# EAGLE design matchbox_bob_v10 (EAGLE 7.4.0)
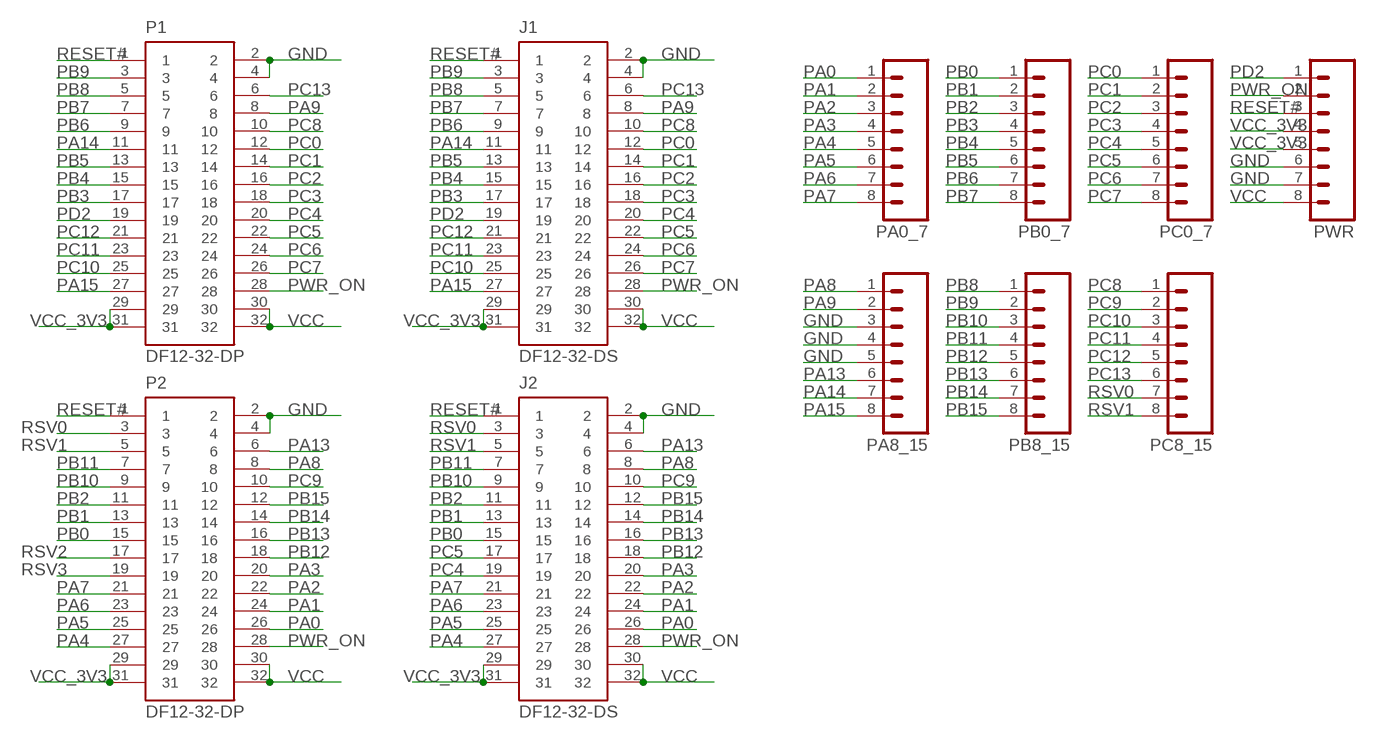
[diagram p0: schematic, sheet 1]

## Parts
J1  DF12-32-DS  AS-ITM-00012  [DF12-32-DS]
J2  DF12-32-DS  AS-ITM-00012  [DF12-32-DS]
P1  DF12-32-DP  AS-ITM-00015  [DF12-32-DP]
P2  DF12-32-DP  AS-ITM-00015  [DF12-32-DP]
PA0_7  M08FEMALE_LOCK  [1X08_FEMALE_LOCK]
PA8_15  M08FEMALE_LOCK  [1X08_FEMALE_LOCK]
PB0_7  M08FEMALE_LOCK  [1X08_FEMALE_LOCK]
PB8_15  M08FEMALE_LOCK  [1X08_FEMALE_LOCK]
PC0_7  M08FEMALE_LOCK  [1X08_FEMALE_LOCK]
PC8_15  M08FEMALE_LOCK  [1X08_FEMALE_LOCK]
PWR  M08FEMALE_LOCK  [1X08_FEMALE_LOCK]

## Nets
GND: J1.2 J1.4 J2.2 J2.4 P1.2 P1.4 P2.2 P2.4 PA8_15.3 PA8_15.4 PA8_15.5 PWR.6 PWR.7
PA0: J2.26 P2.26 PA0_7.1
PA1: J2.24 P2.24 PA0_7.2
PA2: J2.22 P2.22 PA0_7.3
PA3: J2.20 P2.20 PA0_7.4
PA4: J2.27 P2.27 PA0_7.5
PA5: J2.25 P2.25 PA0_7.6
PA6: J2.23 P2.23 PA0_7.7
PA7: J2.21 P2.21 PA0_7.8
PA8: J2.8 P2.8 PA8_15.1
PA9: J1.8 P1.8 PA8_15.2
PA13: J2.6 P2.6 PA8_15.6
PA14: J1.11 P1.11 PA8_15.7
PA15: J1.27 P1.27 PA8_15.8
PB0: J2.15 P2.15 PB0_7.1
PB1: J2.13 P2.13 PB0_7.2
PB2: J2.11 P2.11 PB0_7.3
PB3: J1.17 P1.17 PB0_7.4
PB4: J1.15 P1.15 PB0_7.5
PB5: J1.13 P1.13 PB0_7.6
PB6: J1.9 P1.9 PB0_7.7
PB7: J1.7 P1.7 PB0_7.8
PB8: J1.5 P1.5 PB8_15.1
PB9: J1.3 P1.3 PB8_15.2
PB10: J2.9 P2.9 PB8_15.3
PB11: J2.7 P2.7 PB8_15.4
PB12: J2.18 P2.18 PB8_15.5
PB13: J2.16 P2.16 PB8_15.6
PB14: J2.14 P2.14 PB8_15.7
PB15: J2.12 P2.12 PB8_15.8
PC0: J1.12 P1.12 PC0_7.1
PC1: J1.14 P1.14 PC0_7.2
PC2: J1.16 P1.16 PC0_7.3
PC3: J1.18 P1.18 PC0_7.4
PC4: J1.20 J2.19 P1.20 PC0_7.5
PC5: J1.22 J2.17 P1.22 PC0_7.6
PC6: J1.24 P1.24 PC0_7.7
PC7: J1.26 P1.26 PC0_7.8
PC8: J1.10 P1.10 PC8_15.1
PC9: J2.10 P2.10 PC8_15.2
PC10: J1.25 P1.25 PC8_15.3
PC11: J1.23 P1.23 PC8_15.4
PC12: J1.21 P1.21 PC8_15.5
PC13: J1.6 P1.6 PC8_15.6
PD2: J1.19 P1.19 PWR.1
PWR_ON: J1.28 J2.28 P1.28 P2.28 PWR.2
RESET#: J1.1 J2.1 P1.1 P2.1 PWR.3
RSV0: J2.3 P2.3 PC8_15.7
RSV1: J2.5 P2.5 PC8_15.8
RSV2: P2.17
RSV3: P2.19
VCC: J1.30 J1.32 J2.30 J2.32 P1.30 P1.32 P2.30 P2.32 PWR.8
VCC_3V3: J1.29 J1.31 J2.29 J2.31 P1.29 P1.31 P2.29 P2.31 PWR.4 PWR.5

## Library data of the parts
J1 J2 = micro1292:AS-ITM-00012: CONN RECEPT 32POS 3MM SMD 0.5MM; PARTNO: AS-ITM-00012
P1 P2 = micro1292:AS-ITM-00015: CONN HEADER 32POS 3MM SMD 0.5MM; PARTNO: AS-ITM-00015
PA0_7 PA8_15 PB0_7 PB8_15 PC0_7 PC8_15 PWR = SparkFun-Connectors:M08: Header 8 Standard 8-pin 0.1" header. Use with straight break away headers (SKU : PRT-00116), right angle break away headers (PRT-00553), swiss pins (PRT-00743), machine pins (PRT-00117), and female headers (PRT-00115).

## Board
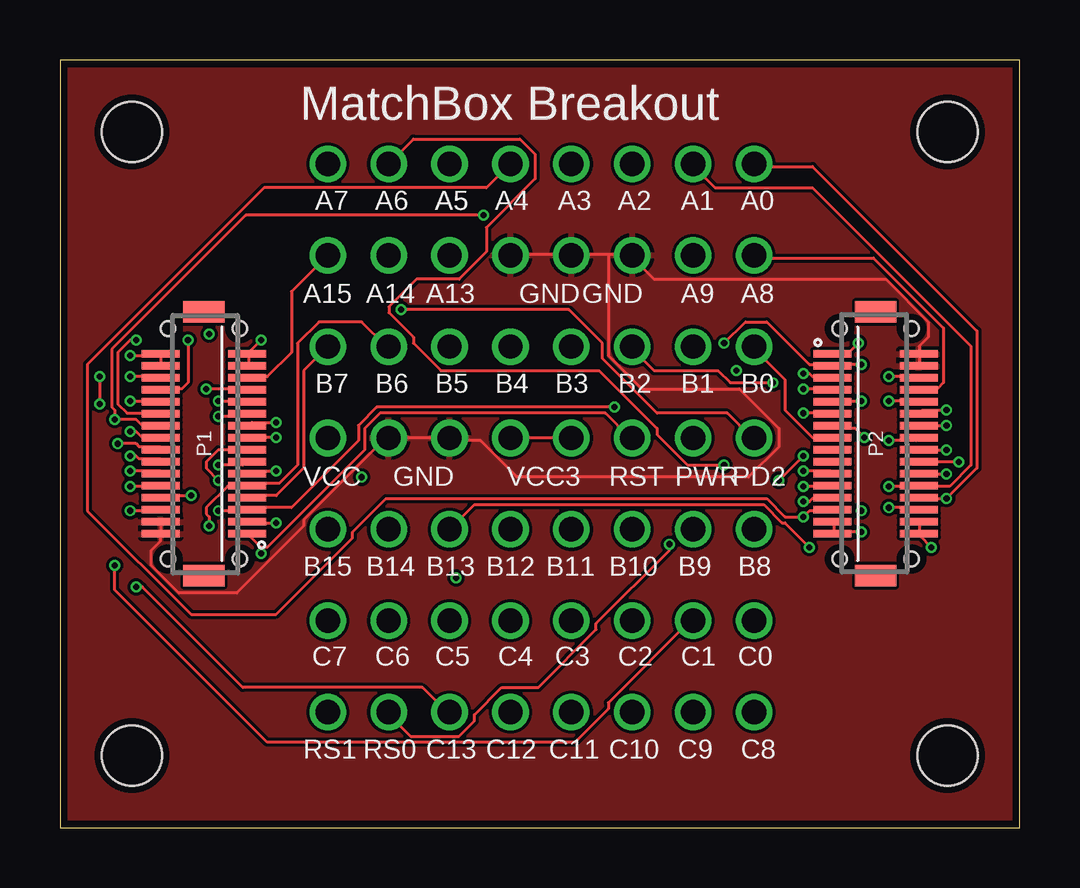
[diagram p1: board, top side]
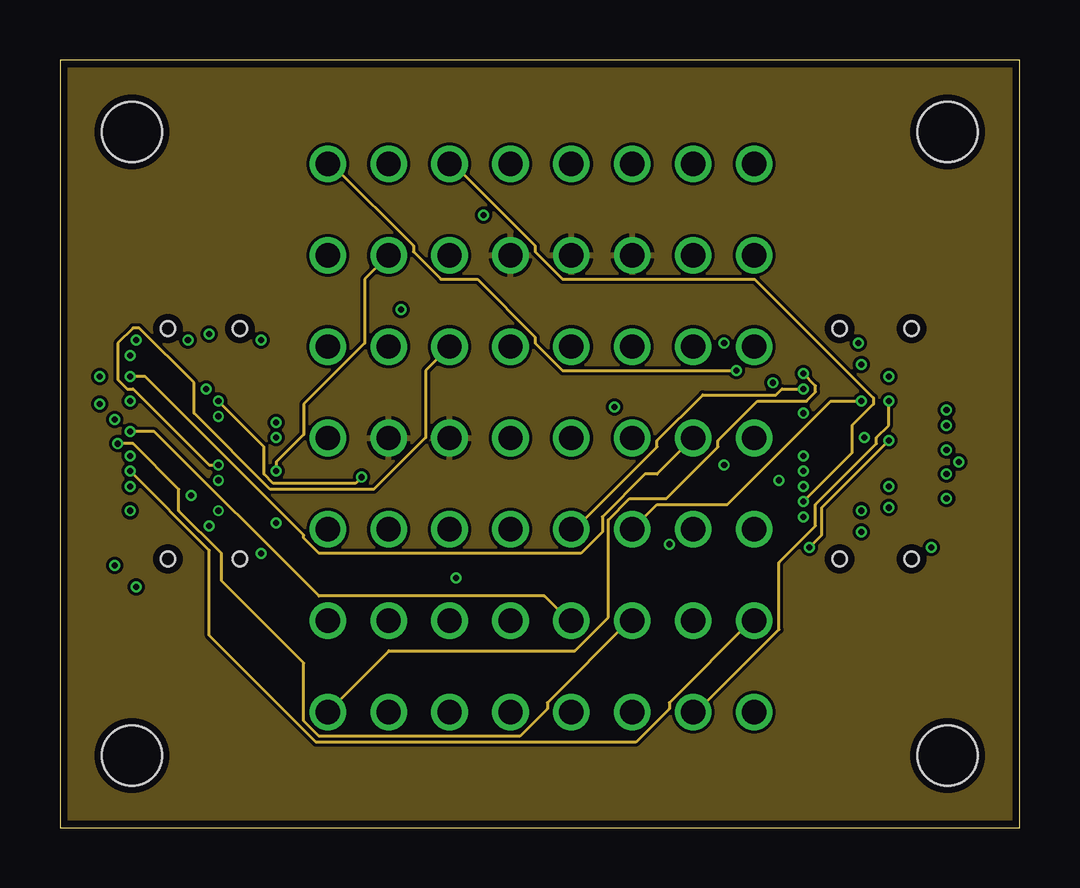
[diagram p2: board, inner layer Route2]
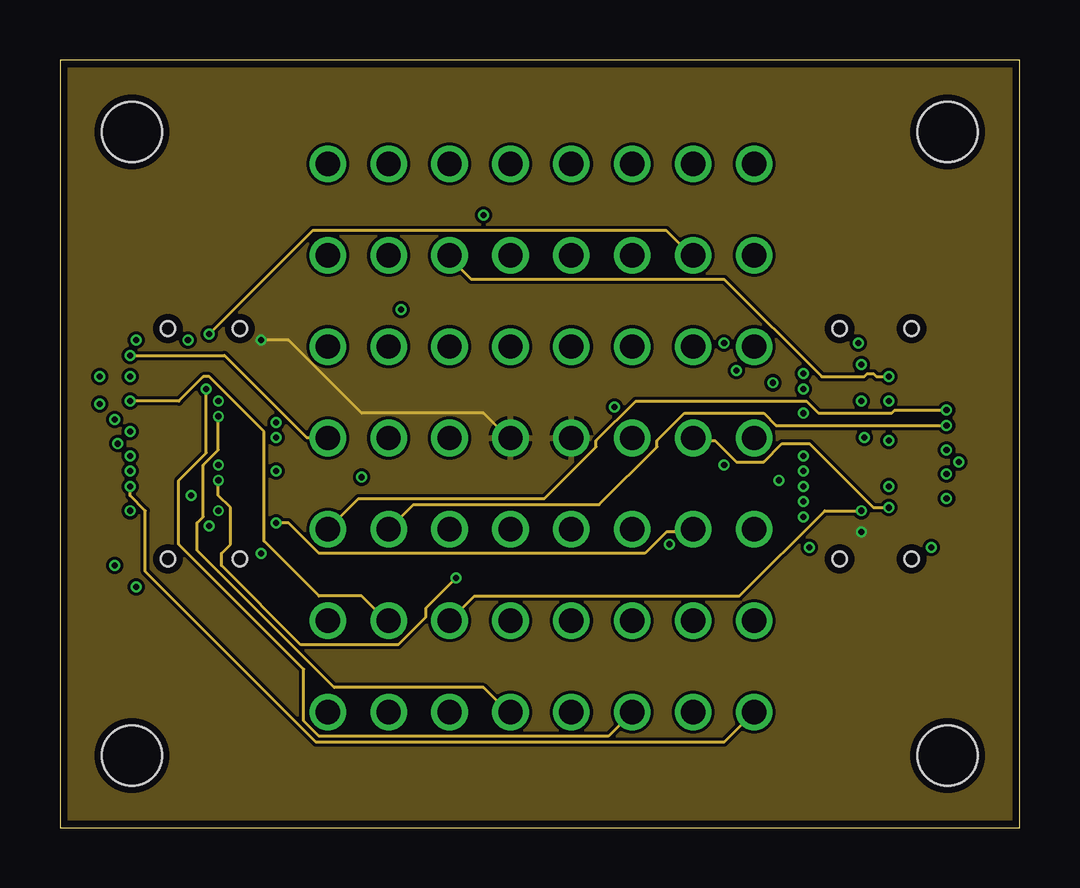
[diagram p3: board, inner layer Route15]
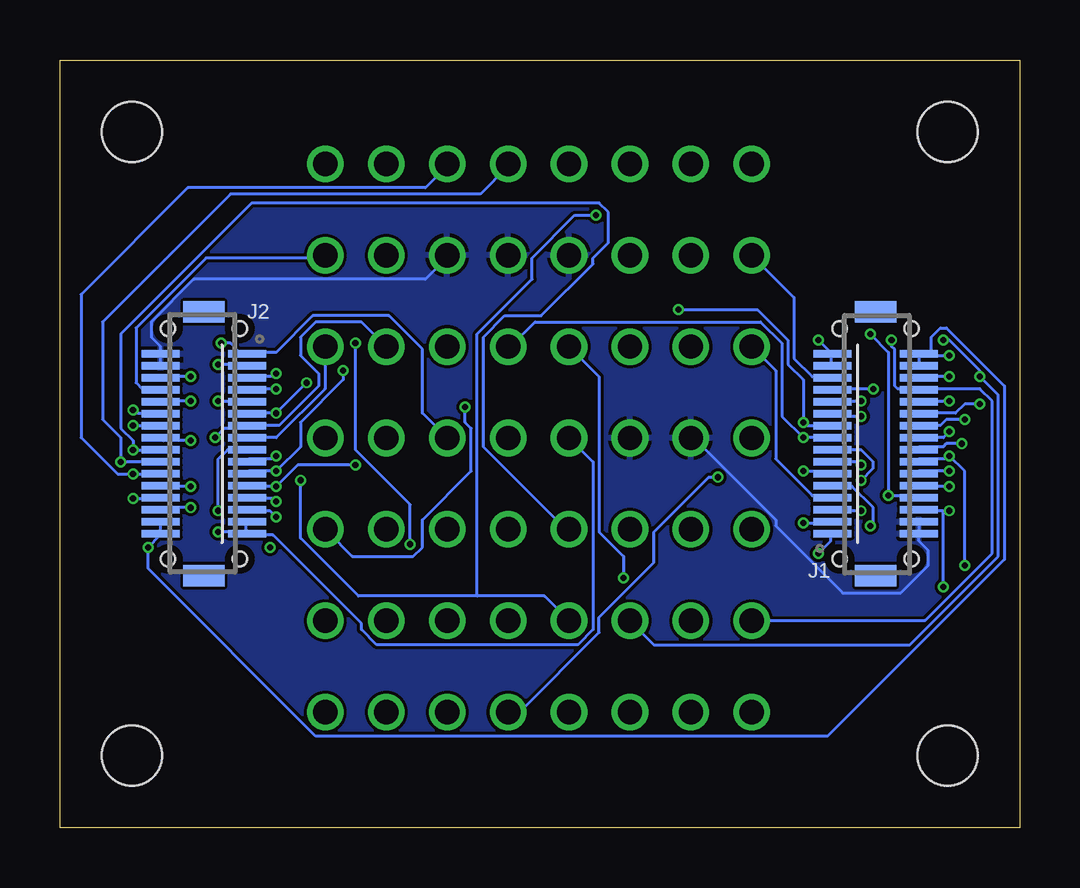
[diagram p4: board, bottom side, seen from below]

Size 40 x 32 mm. Coordinates in mm from the lower left corner, seen from the top.
Outline: 0,0 40,0 40,32 0,32 0,0
Copper layers (1*2*15*16): Top 0.0356mm / dielectric 1.5011mm / Route2 0.0356mm / dielectric 0.1499mm / Route15 0.0356mm / dielectric 0.2007mm / Bottom 0.0356mm
Design rules "Eagle4L": minimum track width 5mil, minimum drill 10mil, track to track 5mil, track to pad 5mil, pad to pad 5mil, via to via 5mil, smd to smd 5mil, copper to edge 12mil, drill to drill 5mil, minimum pad ring 7mil, minimum via ring 4mil, stop-mask expansion 14mil, vias tented up to drill 14mil, thermal gap 6mil
Holes 2.5 mm at 3,29 37,29 37,3 3,3

### Footprints (pad centres in the part's own frame; a part is rotated, then mirrored left to right if it is on the bottom)
DF12-32-DS = smd 0.3 x 1.6: 1 -3.75,1.8; 2 -3.75,-1.8; 3 -3.25,1.8; 4 -3.25,-1.8; 5 -2.75,1.8; 6 -2.75,-1.8; 7 -2.25,1.8; 8 -2.25,-1.8; 9 -1.75,1.8; 10 -1.75,-1.8; 11 -1.25,1.8; 12 -1.25,-1.8; 13 -0.75,1.8; 14 -0.75,-1.8; 15 -0.25,1.8; 16 -0.25,-1.8; 17 0.25,1.8; 18 0.25,-1.8; 19 0.75,1.8; 20 0.75,-1.8; 21 1.25,1.8; 22 1.25,-1.8; 23 1.75,1.8; 24 1.75,-1.8; 25 2.25,1.8; 26 2.25,-1.8; 27 2.75,1.8; 28 2.75,-1.8; 29 3.25,1.8; 30 3.25,-1.8; 31 3.75,1.8; 32 3.75,-1.8 | smd 0.889 x 1.727: F1 -5.5,0; F2 5.5,0 | hole 0.6: -4.8,1.5; 4.8,1.5
DF12-32-DP = smd 0.3 x 1.6: 1 -3.75,-1.8; 2 -3.75,1.8; 3 -3.25,-1.8; 4 -3.25,1.8; 5 -2.75,-1.8; 6 -2.75,1.8; 7 -2.25,-1.8; 8 -2.25,1.8; 9 -1.75,-1.8; 10 -1.75,1.8; 11 -1.25,-1.8; 12 -1.25,1.8; 13 -0.75,-1.8; 14 -0.75,1.8; 15 -0.25,-1.8; 16 -0.25,1.8; 17 0.25,-1.8; 18 0.25,1.8; 19 0.75,-1.8; 20 0.75,1.8; 21 1.25,-1.8; 22 1.25,1.8; 23 1.75,-1.8; 24 1.75,1.8; 25 2.25,-1.8; 26 2.25,1.8; 27 2.75,-1.8; 28 2.75,1.8; 29 3.25,-1.8; 30 3.25,1.8; 31 3.75,-1.8; 32 3.75,1.8 | smd 0.889 x 1.727: F1 -5.5,0; F2 5.5,0 | hole 0.6: -4.8,1.5; 4.8,1.5
1X08_FEMALE_LOCK = drill 1.016: 1 0,0; 2 2.54,0; 3 5.08,0; 4 7.62,0; 5 10.16,0; 6 12.7,0; 7 15.24,0; 8 17.78,0

### Placement (x,y rotation side)
J1  6,16 90 bottom
J2  34,16 270 bottom
P1  6,16 90 top
P2  34,16 270 top
PA0_7  28.94,27.67 180 top
PA8_15  28.94,23.86 180 top
PB0_7  28.94,20.05 180 top
PB8_15  28.94,12.43 180 top
PC0_7  28.94,8.62 180 top
PC8_15  28.94,4.81 180 top
PWR  28.94,16.24 180 top

### Tracks (layer width: path | path; a pad name or v marks a point on that pad's centre or on a via)
GND
  Top 0.127: P1.4 4.19,12.7 4.19,12.32 P1.2 4.19,12.19 4.19,11.94 3.81,11.56 3.81,10.92 4.95,9.78 7.37,9.78 10.16,12.57 10.16,12.83 13.59,16.26 PWR.7 13.72,16.26 16.13,16.26 PWR.6 16.26,16.13 17.53,16.13 19.05,14.61 28.7,14.61 29.97,15.88 29.97,16.64 28.32,18.29 24.26,18.29 22.86,19.68 22.86,23.88 | PA8_15.5 18.8,23.88 21.21,23.88 PA8_15.4 21.34,23.88 22.86,23.88 | P2.4 35.81,19.3 35.81,19.68 P2.2 35.81,19.81 35.81,20.07 36.2,20.45 36.2,21.08 34.42,22.86 24.77,22.86 23.88,23.75 PA8_15.3 23.75,23.88 22.86,23.88
  Bottom 0.127: P1.4 4.19,12.7 4.19,12.32 P1.2 4.19,12.19 4.19,11.94 3.81,11.56 3.81,10.92 4.95,9.78 7.37,9.78 10.16,12.57 10.16,12.83 13.59,16.26 PWR.7 | P2.4 35.81,19.3 35.81,19.68 P2.2 35.81,19.81 35.81,20.07 36.2,20.45 36.2,21.08 34.42,22.86 24.77,22.86 23.88,23.75 PA8_15.3
  pour Route2: 0,0 40,0 40,32 0,32
  pour Top: 0,32 40,32 40,0 0,0
  pour Bottom: 0,32 40,32 40,0 0,0
PA0  (via drill 0.25)
  Top 0.127: P2.26 35.81,13.72 v36.96,13.72 38.23,14.99 38.23,20.7 31.37,27.56 28.96,27.56 PA0_7.1
  Bottom 0.127: v36.96,13.72 35.81,13.72 P2.26
PA1  (via drill 0.25)
  Top 0.127: v34.54,14.22 35.69,14.22 P2.24 35.81,14.22 37.08,14.22 37.97,15.11 37.97,20.07 31.37,26.67 27.3,26.67 26.42,27.56 PA0_7.2
  Bottom 0.127: v34.54,14.22 35.69,14.22 P2.24
PA2  (via drill 0.25)
  Top 0.127: v36.96,14.73 35.81,14.73 P2.22
  Bottom 0.127: P2.22 35.81,14.73 v36.96,14.73 37.59,14.73 39.12,16.26 39.12,22.23 34.67,26.67 24.77,26.67 23.88,27.56 PA0_7.3
PA3  (via drill 0.25)
  Top 0.127: v37.47,15.24 35.81,15.24 P2.20
  Bottom 0.127: P2.20 35.81,15.24 v37.47,15.24 37.47,16.26 38.23,17.02 38.23,21.08 32.89,26.42 22.48,26.42 21.34,27.56 PA0_7.4
PA4  (via drill 0.25)
  Top 0.127: P2.27 32.13,13.21 31.24,13.21 v30.99,12.95 30.23,12.95 29.46,13.72 13.59,13.72 12.19,12.32 12.19,12.06 9.02,8.89 5.46,8.89 1.14,13.21 1.14,19.3 8.51,26.67 17.78,26.67 18.67,27.56 PA0_7.5
  Bottom 0.127: v30.99,12.95 31.24,13.21 32.13,13.21 P2.27
PA5  (via drill 0.25)
  Top 0.127: v30.99,13.59 31.24,13.59 31.37,13.72 32.13,13.72 P2.25
  Route2 0.127: v30.99,13.59 33.02,15.62 33.02,16.76 33.91,17.65 33.91,17.91 28.96,22.86 20.95,22.86 19.81,24 19.81,24.26 16.51,27.56 16.26,27.56 PA0_7.6
  Bottom 0.127: v30.99,13.59 31.11,13.72 32.13,13.72 P2.25
PA6  (via drill 0.25)
  Top 0.127: v30.99,14.22 32.13,14.22 P2.23 | v27.69,15.11 26.16,15.11 24.89,16.38 24.89,16.64 22.48,19.05 15.88,19.05 14.73,20.19 14.73,20.45 13.72,21.46 13.72,21.72 14.86,22.86 16.64,22.86 17.78,24 17.78,25.02 19.81,27.05 19.81,28.07 19.18,28.7 14.73,28.7 13.72,27.69 PA0_7.7
  Bottom 0.127: P2.23 32.13,14.22 v30.99,14.22 30.1,15.11 v27.69,15.11
PA7  (via drill 0.25)
  Top 0.127: v30.99,14.86 32.13,14.86 P2.21
  Route2 0.127: v28.19,19.05 20.95,19.05 19.81,20.19 19.81,20.45 17.4,22.86 15.88,22.86 14.73,24 14.73,24.26 11.43,27.56 11.18,27.56 PA0_7.8
  Bottom 0.127: P2.21 32.13,14.86 v30.99,14.86 29.97,15.88 29.97,16.89 28.19,18.67 v28.19,19.05
PA8
  Top 0.127: P2.8 35.81,18.29 36.58,18.29 36.83,18.54 36.83,20.83 33.91,23.75 28.96,23.75 PA8_15.1
  Bottom 0.127: P2.8 35.81,18.29 36.58,18.29 36.83,18.54 36.83,20.83 33.91,23.75 28.96,23.75 PA8_15.1
PA9  (via drill 0.25)
  Top 0.127: v5.46,13.84 4.32,13.84 P1.8
  Route15 0.127: v6.22,20.57 10.54,24.89 25.27,24.89 26.29,23.88 PA8_15.2
  Bottom 0.127: P1.8 4.32,13.84 v5.46,13.84 5.46,19.81 v6.22,20.57
PA13  (via drill 0.25)
  Top 0.127: v34.54,18.8 35.69,18.8 P2.6
  Route15 0.127: v34.54,18.8 34.04,18.8 33.91,18.92 33.66,18.92 33.53,18.8 31.75,18.8 27.69,22.86 17.14,22.86 16.26,23.75 PA8_15.6
  Bottom 0.127: v34.54,18.8 35.69,18.8 P2.6
PA14  (via drill 0.25)
  Top 0.127: v9.02,14.86 7.87,14.86 P1.11
  Route2 0.127: v9.02,14.86 9.02,15.24 10.16,16.38 10.16,17.65 12.7,20.19 12.7,22.86 13.59,23.75 PA8_15.7
  Bottom 0.127: v9.02,14.86 7.87,14.86 P1.11
PA15
  Top 0.127: P1.27 7.87,18.8 8.64,18.8 9.65,19.81 9.65,22.35 11.05,23.75 PA8_15.8
  Bottom 0.127: P1.27 7.87,18.8 8.64,18.8 9.4,19.56 9.4,22.1 11.05,23.75 PA8_15.8
PB0
  Top 0.127: P2.15 32.13,16.26 31.37,16.26 30.23,17.4 30.23,18.67 28.96,19.94 PB0_7.1
  Bottom 0.127: P2.15 32.13,16.26 30.99,16.26 28.96,18.29 28.96,19.94 PB0_7.1
PB1  (via drill 0.25)
  Top 0.127: v33.53,16.26 33.15,16.64 32.26,16.64 P2.13
  Bottom 0.127: v33.53,16.26 33.15,16.64 32.26,16.64 P2.13 32.13,16.76 30.86,16.76 29.21,18.41 29.21,18.92 29.97,19.68 29.97,20.45 29.34,21.08 27.43,21.08 26.42,20.07 PB0_7.2
PB2  (via drill 0.25)
  Top 0.127: v30.99,17.27 32.13,17.27 P2.11 | v29.72,18.54 27.94,18.54 27.43,19.05 24.77,19.05 23.88,19.94 PB0_7.3
  Bottom 0.127: P2.11 32.13,17.27 v30.99,17.27 v29.72,18.54
PB3  (via drill 0.25)
  Top 0.127: v9.02,16.26 7.87,16.26 P1.17
  Bottom 0.127: P1.17 7.87,16.26 v9.02,16.26 9.91,17.14 9.91,20.19 10.79,21.08 20.19,21.08 21.21,20.07 PB0_7.4
PB4  (via drill 0.25)
  Top 0.127: v6.6,14.48 6.1,14.99 6.1,15.24 6.6,15.75 7.75,15.75 P1.15
  Route15 0.127: v6.6,14.48 6.6,13.84 7.11,13.34 7.11,11.81 6.73,11.43 6.73,10.92 10.03,7.62 14.1,7.62 15.24,8.76 15.24,9.14 v16.51,10.41
  Bottom 0.127: v6.6,14.48 6.1,14.99 6.1,15.24 6.6,15.75 7.75,15.75 P1.15 | v16.51,10.41 16.51,11.3 17.53,12.32 17.53,18.8 18.67,19.94 PB0_7.5
PB5  (via drill 0.25)
  Top 0.127: v6.6,15.11 7.62,15.11 7.75,15.24 P1.13
  Route2 0.127: v6.6,15.11 6.22,15.11 3.05,18.29 2.79,18.29 2.41,18.67 2.41,20.19 3.05,20.83 3.3,20.83 5.59,18.54 5.59,17.27 8.76,14.1 13.08,14.1 15.24,16.26 15.24,19.05 16.13,19.94 PB0_7.6
  Bottom 0.127: v6.6,15.11 6.73,15.24 7.75,15.24 P1.13
PB6  (via drill 0.25)
  Top 0.127: PB0_7.7 13.59,20.07 12.57,21.08 10.79,21.08 9.91,20.19 9.91,15.11 9.14,14.35 7.87,14.35 P1.9 7.75,14.22 6.99,14.22 6.1,13.34 6.1,13.08 6.22,12.95 v6.22,12.57
  Bottom 0.127: v6.22,12.57 6.1,12.7 6.1,13.34 6.99,14.22 7.75,14.22 P1.9
PB7
  Top 0.127: P1.7 7.87,13.84 9.02,13.84 10.16,14.99 10.16,19.05 11.05,19.94 PB0_7.8
  Bottom 0.127: P1.7 7.87,13.84 8.64,13.84 10.16,15.37 10.16,19.05 11.05,19.94 PB0_7.8
PB8  (via drill 0.25)
  Top 0.127: v6.6,13.21 7.75,13.21 P1.5 7.87,13.34 9.65,13.34 12.45,16.13 12.45,16.76 13.21,17.53 v23.11,17.53
  Bottom 0.127: v6.6,13.21 7.75,13.21 P1.5 | v23.11,17.53 23.11,16.89 22.86,16.64 22.86,14.86 24.89,12.83 24.89,11.68 25.27,11.3 27.81,11.3 28.83,12.32 PB8_15.1
PB9  (via drill 0.25)
  Top 0.127: v9.02,12.7 7.87,12.7 P1.3
  Route15 0.127: v9.02,12.7 9.53,12.7 10.79,11.43 24.38,11.43 25.27,12.32 26.29,12.32 PB8_15.2
  Bottom 0.127: v9.02,12.7 7.87,12.7 P1.3
PB10  (via drill 0.25)
  Top 0.127: v33.4,17.78 32.26,17.78 P2.9
  Route2 0.127: v33.4,17.78 32.13,17.78 27.81,13.46 24.89,13.46 23.88,12.45 PB8_15.3
  Bottom 0.127: v33.4,17.78 32.26,17.78 P2.9
PB11  (via drill 0.25)
  Top 0.127: v30.99,18.29 32.13,18.29 P2.7
  Route2 0.127: v30.99,18.29 30.1,18.29 29.84,18.03 26.8,18.03 24.89,16.13 24.89,15.88 21.34,12.32 PB8_15.4
  Bottom 0.127: v30.99,18.29 32.13,18.29 P2.7
PB12  (via drill 0.25)
  Top 0.127: v36.96,15.75 35.81,15.75 P2.18
  Bottom 0.127: P2.18 35.81,15.75 v36.96,15.75 36.96,16.13 37.47,16.64 37.47,20.57 32,26.04 17.53,26.04 17.14,25.65 17.14,24.38 17.78,23.75 17.78,23.5 19.94,21.34 21.46,21.34 22.35,20.45 22.35,15.88 18.8,12.32 PB8_15.5
PB13  (via drill 0.25)
  Top 0.127: v34.54,16.13 35.69,16.13 P2.16 | v31.24,11.68 30.23,12.7 30.1,12.7 29.34,13.46 17.27,13.46 16.26,12.45 PB8_15.6
  Route2 0.127: v34.54,16.13 31.75,13.34 31.75,12.19 v31.24,11.68
  Bottom 0.127: v34.54,16.13 35.69,16.13 P2.16
PB14  (via drill 0.25)
  Top 0.127: v36.96,16.76 35.81,16.76 P2.14
  Route15 0.127: v36.96,16.76 29.84,16.76 29.34,17.27 26.04,17.27 24.89,16.13 24.89,15.88 22.48,13.46 14.73,13.46 13.72,12.45 PB8_15.7
  Bottom 0.127: v36.96,16.76 35.81,16.76 P2.14
PB15  (via drill 0.25)
  Top 0.127: v36.96,17.4 35.94,17.4 35.81,17.27 P2.12
  Route15 0.127: v36.96,17.4 34.8,17.4 34.67,17.27 31.62,17.27 31.11,17.78 24,17.78 22.35,16.13 22.35,15.88 20.19,13.72 12.45,13.72 11.18,12.45 PB8_15.8
  Bottom 0.127: v36.96,17.4 36.83,17.27 35.81,17.27 P2.12
PC0  (via drill 0.25)
  Top 0.127: v2.92,14.86 4.19,14.86 P1.12
  Route2 0.127: v2.92,14.86 6.22,11.56 6.22,8 10.67,3.56 24,3.56 25.4,4.95 25.4,5.21 28.83,8.64 PC0_7.1
  Bottom 0.127: v2.92,14.86 4.19,14.86 P1.12
PC1  (via drill 0.25)
  Top 0.127: v2.92,15.49 3.17,15.49 3.3,15.37 4.19,15.37 P1.14 | v2.29,10.92 2.29,9.91 8.64,3.56 21.46,3.56 22.86,4.95 22.86,5.21 26.29,8.64 PC0_7.2
  Bottom 0.127: P1.14 4.19,15.37 3.05,15.37 v2.92,15.49 2.29,14.86 v2.29,10.92
PC2  (via drill 0.25)
  Top 0.127: v2.41,16 3.17,16 3.3,15.88 4.19,15.88 P1.16
  Route2 0.127: v2.41,16 3.05,16 4.95,14.1 4.95,13.21 6.73,11.43 6.73,10.29 10.16,6.86 10.16,4.45 10.79,3.81 19.18,3.81 20.32,4.95 20.32,5.21 23.75,8.64 PC0_7.3
  Bottom 0.127: v2.41,16 3.05,16 3.17,15.88 4.19,15.88 P1.16
PC3  (via drill 0.25)
  Top 0.127: v2.92,16.51 3.17,16.51 3.43,16.26 P1.18
  Route2 0.127: v2.92,16.51 3.94,16.51 10.79,9.65 20.19,9.65 21.21,8.64 PC0_7.4
  Bottom 0.127: v2.92,16.51 3.17,16.26 P1.18
PC4  (via drill 0.25)
  Top 0.127: P1.20 4.19,16.76 3.43,16.76 3.17,17.02 v2.29,17.02 2.29,17.4 2.16,17.53 2.16,19.94 7.75,25.53 v17.65,25.53 | v29.97,14.48 v30.99,15.49
  Bottom 0.127: v2.29,17.02 3.05,17.02 3.3,16.76 4.19,16.76 P1.20 | v30.99,15.49 31.11,15.37 32.13,15.37 J2.19 | v29.97,14.48 29.97,12.06 27.56,9.65 22.61,9.65 | 22.61,9.65 19.81,9.65 18.8,8.64 PC0_7.5 | v17.65,25.53 18.54,25.53 20.32,23.75 20.32,22.86 22.61,20.57 22.61,9.65
PC5  (via drill 0.25)
  Top 0.127: v1.65,18.8 v1.65,17.65 | v3.17,20.32 2.92,20.32 2.41,19.81 2.41,17.65 2.79,17.27 4.19,17.27 P1.22
  Route15 0.127: v33.4,13.21 31.88,13.21 28.32,9.65 17.27,9.65 16.26,8.64 PC0_7.6
  Bottom 0.127: v1.65,17.65 2.29,17.65 2.67,17.27 4.19,17.27 P1.22 | PC0_7.6 16.13,8.51 15.24,7.62 4.57,7.62 0.89,11.3 0.89,18.03 v1.65,18.8 1.65,19.05 2.92,20.32 v3.17,20.32 | v33.4,13.21 33.4,15.37 33.02,15.75 32.26,15.75 J2.17
PC6  (via drill 0.25)
  Top 0.127: v2.92,17.78 4.19,17.78 P1.24
  Route15 0.127: v2.92,17.78 4.95,17.78 5.97,18.8 6.22,18.8 8.51,16.51 8.51,11.94 10.79,9.65 12.57,9.65 13.59,8.64 PC0_7.7
  Bottom 0.127: v2.92,17.78 4.19,17.78 P1.24
PC7  (via drill 0.25)
  Top 0.127: v5.33,20.32 5.33,18.54 5.08,18.29 4.32,18.29 P1.26
  Bottom 0.127: PC0_7.8 11.05,8.64 3.94,8.64 1.14,11.43 1.14,17.78 1.65,18.29 4.19,18.29 P1.26 4.32,18.29 5.08,18.29 5.21,18.41 5.21,19.94 5.33,20.07 v5.33,20.32
PC8  (via drill 0.25)
  Top 0.127: v2.92,14.22 4.19,14.22 P1.10
  Route15 0.127: v2.92,14.22 2.92,13.84 3.56,13.21 3.56,10.67 10.67,3.56 27.69,3.56 28.83,4.7 PC8_15.1
  Bottom 0.127: v2.92,14.22 4.19,14.22 P1.10
PC9  (via drill 0.25)
  Top 0.127: v34.54,17.78 35.69,17.78 P2.10
  Route2 0.127: v34.54,17.78 34.54,16.76 34.04,16.26 34.04,16 31.5,13.46 31.5,12.57 29.97,11.05 29.97,8.26 26.42,4.7 PC8_15.2
  Bottom 0.127: v34.54,17.78 35.69,17.78 P2.10
PC10  (via drill 0.25)
  Top 0.127: v6.1,18.29 7.75,18.29 P1.25
  Route15 0.127: v6.1,18.29 6.1,15.62 4.95,14.48 4.95,11.81 10.16,6.6 10.16,4.45 10.79,3.81 22.86,3.81 23.75,4.7 PC8_15.3
  Bottom 0.127: v6.1,18.29 7.75,18.29 P1.25
PC11  (via drill 0.25)
  Top 0.127: v6.6,17.78 7.75,17.78 P1.23
  Route2 0.127: v6.6,17.78 8.51,15.88 8.51,14.73 8.89,14.35 12.32,14.35 v12.57,14.61
  Bottom 0.127: v6.6,17.78 7.75,17.78 P1.23 | v12.57,14.61 12.95,14.61 15.24,12.32 15.24,11.05 17.53,8.76 17.53,8.13 20.83,4.83 21.21,4.83 PC8_15.4
PC12  (via drill 0.25)
  Top 0.127: v6.6,17.14 7.75,17.14 P1.21
  Route15 0.127: v6.6,17.14 6.6,15.75 5.97,15.11 5.97,12.95 5.71,12.7 5.71,11.56 11.43,5.84 17.65,5.84 18.67,4.83 PC8_15.5
  Bottom 0.127: v6.6,17.14 7.75,17.14 P1.21
PC13  (via drill 0.25)
  Top 0.127: v2.92,13.21 4.19,13.21 P1.6 | v3.17,10.03 3.43,10.03 7.62,5.84 15.11,5.84 16.13,4.83 PC8_15.6
  Bottom 0.127: v2.92,13.21 3.17,13.21 | 3.17,13.21 4.19,13.21 P1.6 | v3.17,10.03 3.17,13.21
PD2  (via drill 0.25)
  Top 0.127: v9.02,16.89 8,16.89 7.87,16.76 P1.19 | v14.22,21.59 21.21,21.59 22.61,20.19 22.61,19.56 24.89,17.27 27.81,17.27 28.83,16.26 PWR.1
  Bottom 0.127: P1.19 7.87,16.76 8.89,16.76 v9.02,16.89 9.02,18.67 9.65,19.3 9.65,20.32 10.92,21.59 v14.22,21.59
PWR_ON  (via drill 0.25)
  Top 0.127: v2.92,18.8 4.19,18.8 P1.28 | v34.54,13.34 35.69,13.34 P2.28
  Route2 0.127: v2.92,18.8 3.56,18.8 10.16,12.19 10.16,12.06 10.79,11.43 21.72,11.43 22.61,12.32 22.61,12.95 24.38,14.73 24.89,14.73 26.29,16.13 PWR.2
  Route15 0.127: v34.54,13.34 33.91,13.34 31.24,16 30.1,16 29.34,15.24 28.19,15.24 27.3,16.13 26.42,16.13 PWR.2
  Bottom 0.127: v2.92,18.8 4.19,18.8 P1.28 | v34.54,13.34 35.69,13.34 P2.28
RESET#  (via drill 0.25)
  Top 0.127: v33.27,20.19 32.89,19.81 32.26,19.81 P2.1 | 8.38,11.68 v8.38,11.43 | 8.38,11.68 7.87,12.19 P1.1 | 8.38,11.68 8.64,11.68 12.7,15.75 12.7,16.64 13.34,17.27 22.73,17.27 23.75,16.26 PWR.3
  Bottom 0.127: v33.27,20.19 32.89,20.19 32.51,19.81 32.26,19.81 P2.1 32.13,19.81 30.99,19.81 29.46,21.34 26.29,21.34 24.89,19.94 24.89,17.27 23.88,16.26 PWR.3 | v8.38,11.43 7.87,11.94 7.87,12.19 P1.1
RSV0  (via drill 0.25)
  Top 0.127: v33.4,19.3 32.26,19.3 P2.3 32.13,19.3 31.24,19.3 29.46,21.08 28.57,21.08 v27.69,20.19 | v25.4,11.81 25.4,11.56 22.35,8.51 22.35,8.26 19.94,5.84 18.41,5.84 17.27,4.7 17.27,4.45 16.64,3.81 14.61,3.81 13.72,4.7 PC8_15.7
  Bottom 0.127: v33.4,19.3 32.26,19.3 P2.3 | v27.69,20.19 27.69,15.75 25.4,13.46 v25.4,11.81
RSV1  (via drill 0.25)
  Top 0.127: v30.99,18.92 31.24,18.92 31.37,18.8 32.13,18.8 P2.5
  Route2 0.127: v30.99,18.92 31.5,18.41 31.5,18.16 31.11,17.78 29.08,17.78 27.43,16.13 27.43,15.88 25.27,13.72 23.75,13.72 22.86,12.83 22.86,8.76 21.46,7.37 13.72,7.37 11.18,4.83 PC8_15.8
  Bottom 0.127: v30.99,18.92 31.11,18.8 32.13,18.8 P2.5
VCC  (via drill 0.25)
  Top 0.127: P2.30 35.81,12.7 35.81,12.32 P2.32 35.81,12.19 v36.32,11.68 | 4.19,19.68 4.19,19.3 P1.30 | 4.19,19.68 P1.32 4.19,19.68 | v2.92,19.68 4.19,19.68
  Route15 0.127: v2.92,19.68 6.86,19.68 10.29,16.26 11.05,16.26 PWR.8
  Bottom 0.127: P2.30 35.81,12.7 35.81,12.32 P2.32 35.81,12.19 v36.32,11.68 36.32,10.79 29.34,3.81 8,3.81 0.64,11.18 0.64,18.41 3.05,20.83 3.3,20.83 3.68,20.45 3.68,19.68 | 4.19,19.68 4.19,19.3 P1.30 | 4.19,19.68 P1.32 | 4.19,19.68 3.68,19.68 | 3.68,19.68 v2.92,19.68 | 4.19,19.68 P1.32 | 3.68,19.68 P1.32
VCC_3V3  (via drill 0.25)
  Top 0.127: 32.26,12.32 32.26,12.7 P2.29 | 32.26,12.32 P2.31 32.26,12.32 | v33.4,12.32 32.26,12.32 | P1.29 7.87,19.3 7.87,19.68 P1.31 7.87,19.81 v8.38,20.32 | PWR.4 21.21,16.26 18.8,16.26 PWR.5
  Route15 0.127: v8.38,20.32 9.53,20.32 12.57,17.27 17.65,17.27 18.67,16.26 PWR.5
  Bottom 0.127: 32.26,12.32 32.26,12.7 P2.29 | 32.26,12.32 P2.31 | 32.26,12.32 v33.4,12.32 | 32.26,12.32 P2.31 | P1.29 7.87,19.3 7.87,19.68 P1.31 7.87,19.81 v8.38,20.32 | P2.31 32.13,12.19 31.11,12.19 27.43,8.51 27.43,8.26 26.8,7.62 18.41,7.62 17.78,8.26 17.78,15.24 18.67,16.13 PWR.5
  pour Route15: 0,0 40,0 40,32 0,32

### Text on the board
tPlace: A7 | A6 | A5 | A5 | A4 | A3 | A2 | A1 | A0 | A15 | A14 | A13 | GND | GND | A9 | A8 | B7 | B6 | B5 | B4 | B3 | B2 | B1 | B0 | VCC | GND | VCC3 | RST | PWR | PD2 | B15 | B14 | B13 | B12 | B11 | B10 | B9 | B8 | C7 | C6 | C5 | C4 | C3 | C2 | C1 | C0 | RS1 | RS0 | C13 | C12 | C11 | C10 | C9 | C8
tNames: MatchBox Breakout